# Altium schematic sheet Sheet1.SchDoc
size A; SheetNumber: 1; SheetTotal: 1
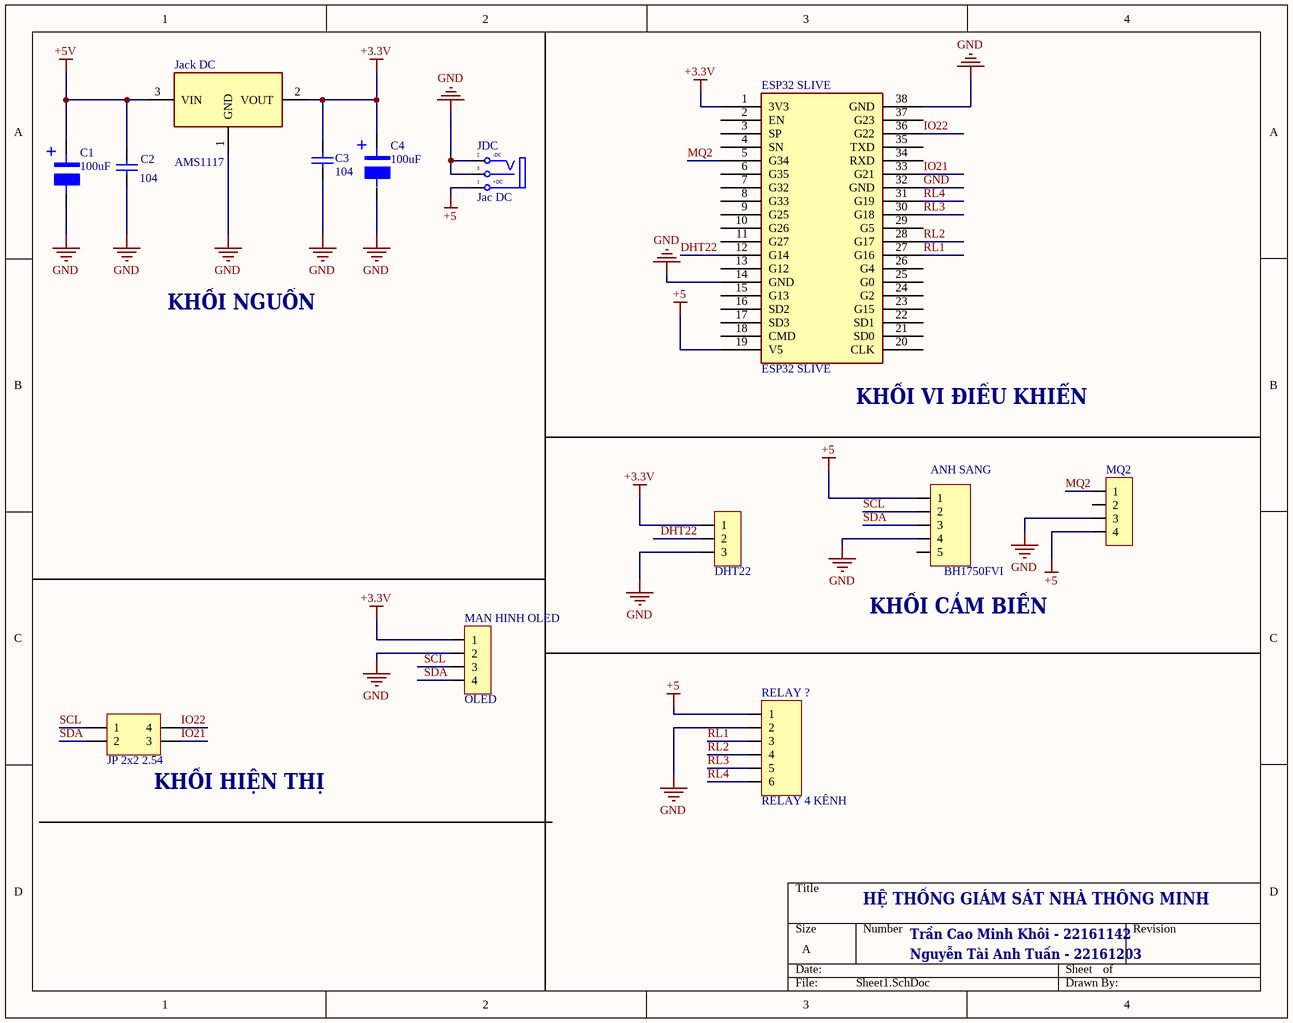
[diagram p0: Sheet1.SchDoc]

## Parts
ANH_SANG  BH1750FVI  [JP 1x5 DT]
C1  100uF  [100UF/16V_SMD]
C2  104  [tu 1206]
C3  104  [tu 1206]
C4  100uF  [100UF/16V_SMD]
DHT22  DHT22  [JP 1x3 CT]
ESP32_SLIVE  ESP32 SLIVE  [ESP32_38]
Jack_DC  AMS1117  [AMS1117]
JDC  Jac DC  [DC-IN]
JP8  JP 2x2 2.54  [JP 2x2 DT]
MAN_HINH_OLED  OLED  [JP 1x4 DT]
MQ2  MQ2  [JP 1x4 CT]  (value not drawn)
RELAY_?  RELAY 4 KÊNH  [JP 1x6 DC]

## Nets
+3.3V: C3.1 C4.1 DHT22.1 ESP32_SLIVE.1(3V3) Jack_DC.2(VOUT) MAN_HINH_OLED.1
+5: ANH_SANG.1 ESP32_SLIVE.19(V5) JDC.1(T) MQ2.4 RELAY_?.1
+5V: C1.1 C2.1 Jack_DC.3(VIN)
GND: ANH_SANG.4 C1.2 C2.2 C3.2 C4.2 DHT22.3 ESP32_SLIVE.14(GND) ESP32_SLIVE.32(GND) ESP32_SLIVE.38(GND) Jack_DC.1(GND) JDC.2(TN) JDC.3(S) MAN_HINH_OLED.2 MQ2.3 RELAY_?.2
DHT22: DHT22.2 ESP32_SLIVE.12(G14)
IO21: ESP32_SLIVE.33(G21) JP8.3
IO22: ESP32_SLIVE.36(G22) JP8.4
MQ2: ESP32_SLIVE.5(G34) MQ2.1
RL1: ESP32_SLIVE.27(G16) RELAY_?.3
RL2: ESP32_SLIVE.28(G17) RELAY_?.4
RL3: ESP32_SLIVE.30(G18) RELAY_?.5
RL4: ESP32_SLIVE.31(G19) RELAY_?.6
SCL: ANH_SANG.2 JP8.1 MAN_HINH_OLED.3
SDA: ANH_SANG.3 JP8.2 MAN_HINH_OLED.4

Not connected (* = marked no-connect by the designer): ANH_SANG 5; ESP32_SLIVE 2(EN) 3(SP) 4(SN) 6(G35) 7(G32) 8(G33) 9(G25) 10(G26) 11(G27) 13(G12) 15(G13) 16(SD2) 17(SD3) 18(CMD) 20(CLK) 21(SD0) 22(SD1) 23(G15) 24(G2) 25(G0) 26(G4) 29(G5) 34(RXD) 35(TXD) 37(G23); MQ2 2

## Notes on the sheet
- KHỐI NGUỒN
- (near ESP32_SLIVE) KHỐI VI ĐIỀU KHIỂN
- (near ANH_SANG) KHỐI CẢM BIẾN
- (near JP8) KHỐI HIỆN THỊ
- HỆ THỐNG GIÁM SÁT NHÀ THÔNG MINH
- Trần Cao Minh Khôi - 22161142
- Nguyễn Tài Anh Tuấn - 22161203
- (in symbol Cap100uF_SMD) +
- (in symbol DCIN) -DC; +DC

## Library data of the parts
ANH_SANG = JP 1x5 2.54 Duc Thang: Cắm; Ten_Linh_Kien: Jump Đơn Đực 2.54MM 1x40P Thẳng 11MM; Don_Vi: Con; Ma_Hang: MH000903; Ghi_Chu: *; Kieu_Chan: *; Chung_Loai: Cắm
C1 C4 = Cap100uF_SMD: Value: 100uF
C2 C3 = Tu 1206 104 50V 20%: Dán; Don_Vi: Con; So_Chan: 2; Ten_Linh_Kien: Tụ 1206 104-0.1uF 20% 50V; Ma_Hang: MH004544; Chung_Loai: Dán; Kieu_Chan: *
DHT22 = JP 1x3 2.54 Cai Thang: Cắm; Ten_Linh_Kien: Jump Đơn Cái 2.54MM 1x20P Thẳng; Don_Vi: Con; Ma_Hang: MH004006; Ghi_Chu: *; Kieu_Chan: *; Chung_Loai: Cắm
ESP32_SLIVE = ESP32_38: Microcontoller Board 38 Pins Wifi 2.4GHz BLE 4.2 ESP32-WROOM-32D; ComponentLink1Description: Datasheet; ComponentLink1URL: https://www.mouser.com/datasheet/2/891/esp32_wroom_32d_esp32_wroom_32u_datasheet_en-1365844.pdf
Jack_DC = AMS1117: IC REG LINEAR 1A SOT-89-3L; ComponentLink1Description: Datasheet; ComponentLink1URL: http://www.advanced-monolithic.com/pdf/ds1117.pdf; Digikey PN: 4518-AMS1117-3.3CT-ND; JLCPCB PN: C963410
JDC = DCIN: Jac DC input; Value: Jac DC
JP8 = JP 2x2 2.54 Duc Thang: Cắm; Ten_Linh_Kien: Jump Đôi Đực 2.54MM 2x40P Thẳng 11MM; Don_Vi: Con; Ma_Hang: MH002686; Ghi_Chu: *; Kieu_Chan: *; Chung_Loai: Cắm
MAN_HINH_OLED = JP 1x4 2.54 Duc Thang: Cắm; Ten_Linh_Kien: Jump Đơn Đực 2.54MM 1x40P Thẳng 11MM; Don_Vi: Con; Ma_Hang: MH000903; Ghi_Chu: *; Kieu_Chan: *; Chung_Loai: Cắm
MQ2 = JP 1x4 2.54 Cai Thang: Cắm; Ten_Linh_Kien: Jump Đơn Cái 2.54MM 1x20P Thẳng; Don_Vi: Con; Ma_Hang: MH004006; Ghi_Chu: *; Kieu_Chan: *; Chung_Loai: Cắm
RELAY_? = JP 1x6 2.54 Duc Cong: Cắm; Ten_Linh_Kien: Jump Đơn Đực 2.54MM 1x40P Cong Đứng; Don_Vi: Con; Ma_Hang: MH000904; Ghi_Chu: *; Kieu_Chan: *; Chung_Loai: Cắm